# EAGLE design headphone (EAGLE 6.1)
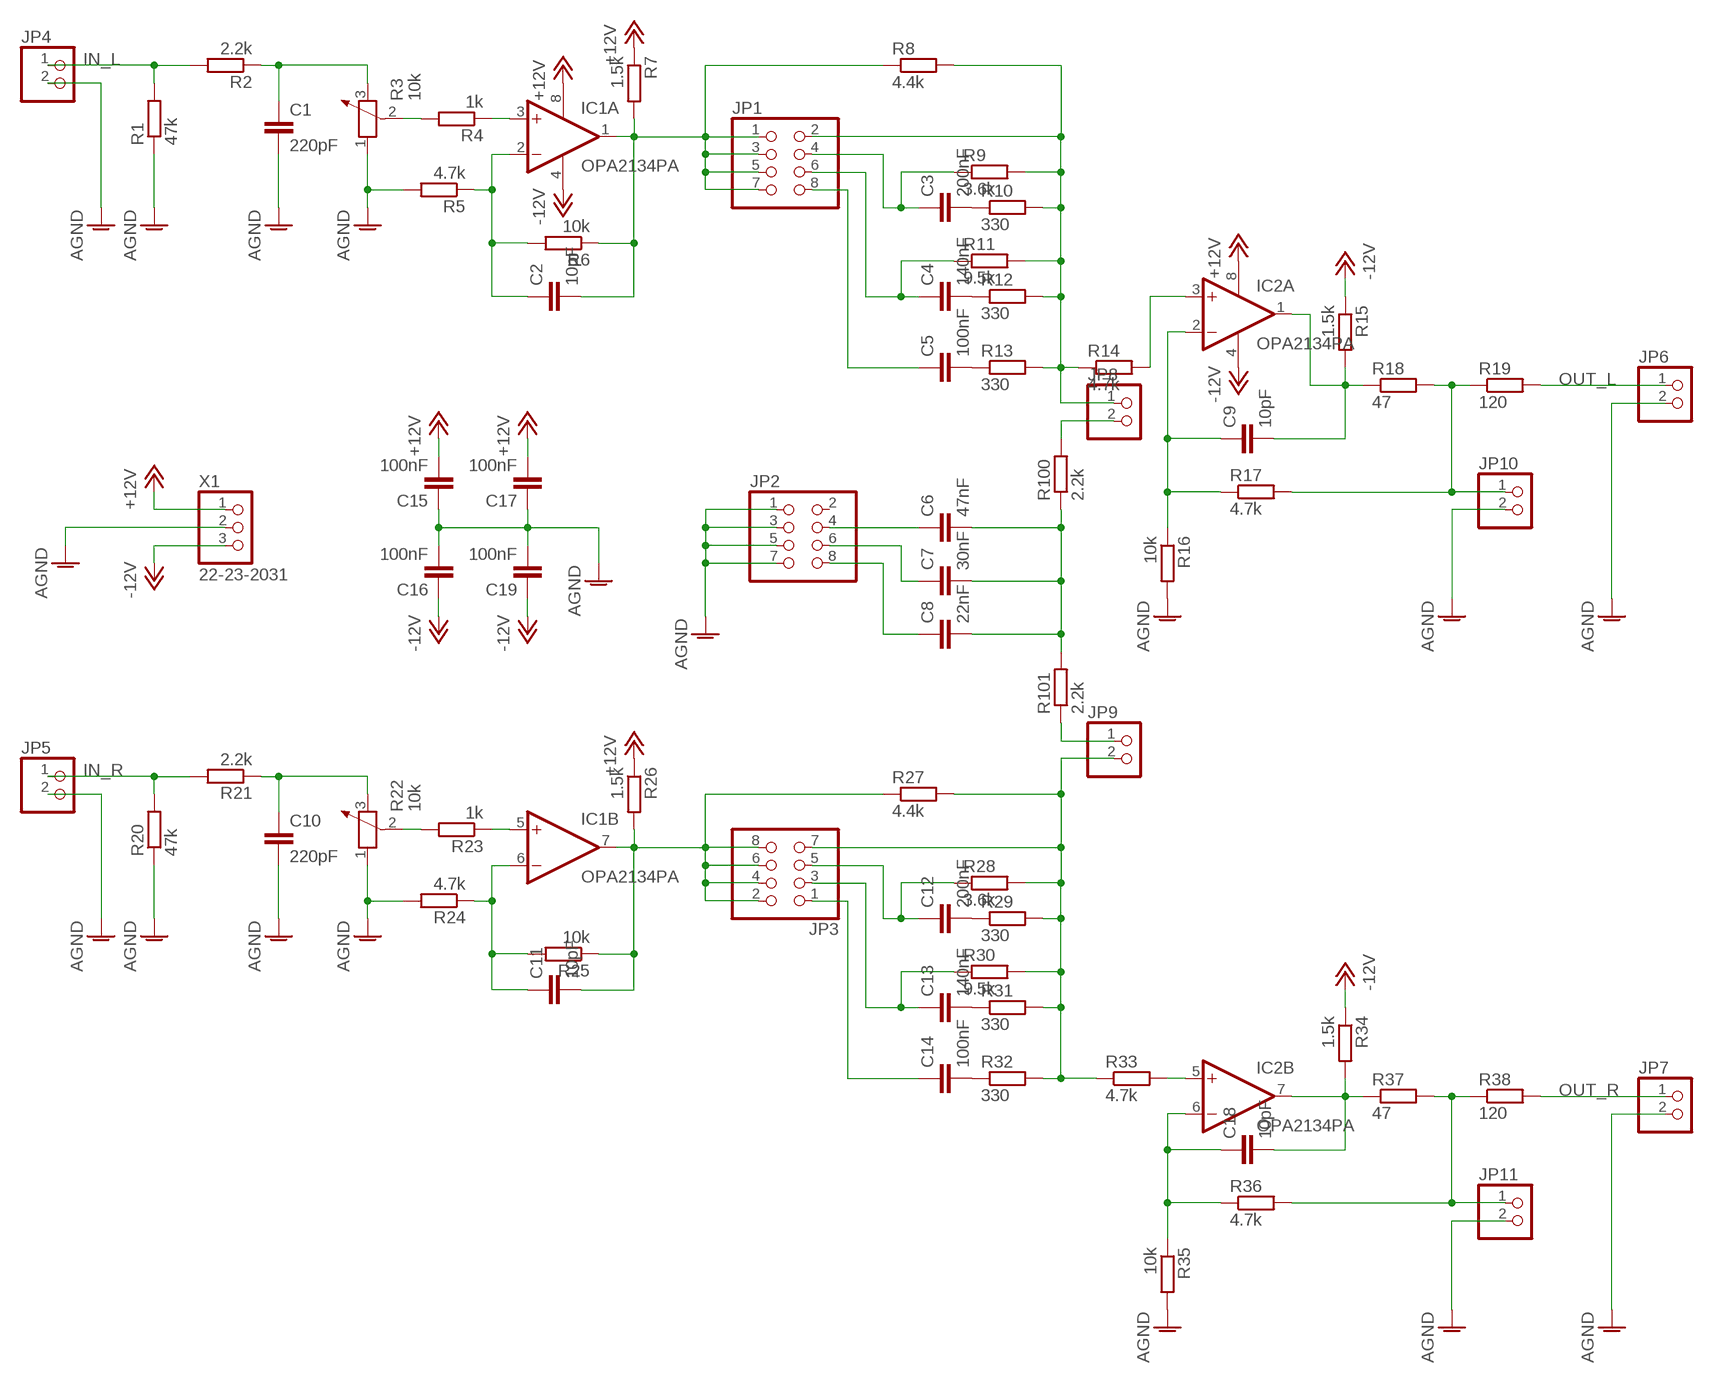
[diagram p0: schematic, sheet 1]

## Parts
C1  220pF  C-EU025-025X050  [C025-025X050]
C2  10pF  C-EU050-025X075  [C050-025X075]
C3  200nF  C-EU050-025X075  [C050-025X075]
C4  140nF  C-EU050-025X075  [C050-025X075]
C5  100nF  C-EU050-025X075  [C050-025X075]
C6  47nF  C-EU050-025X075  [C050-025X075]
C7  30nF  C-EU050-025X075  [C050-025X075]
C8  22nF  C-EU050-025X075  [C050-025X075]
C9  10pF  C-EU050-025X075  [C050-025X075]
C10  220pF  C-EU025-025X050  [C025-025X050]
C11  10pF  C-EU050-025X075  [C050-025X075]
C12  200nF  C-EU050-025X075  [C050-025X075]
C13  140nF  C-EU050-025X075  [C050-025X075]
C14  100nF  C-EU050-025X075  [C050-025X075]
C15  100nF  C-EU050-025X075  [C050-025X075]
C16  100nF  C-EU050-025X075  [C050-025X075]
C17  100nF  C-EU050-025X075  [C050-025X075]
C18  10pF  C-EU050-025X075  [C050-025X075]
C19  100nF  C-EU050-025X075  [C050-025X075]
IC1  OPA2134PA  [DIL08]
IC2  OPA2134PA  [DIL08]
JP1  PINHD-2X4  [2X04]
JP2  PINHD-2X4  [2X04]
JP3  PINHD-2X4  [2X04]
JP4  PINHD-1X2  [1X02]
JP5  PINHD-1X2  [1X02]
JP6  PINHD-1X2  [1X02]
JP7  PINHD-1X2  [1X02]
JP8  PINHD-1X2  [1X02]
JP9  PINHD-1X2  [1X02]
JP10  PINHD-1X2  [1X02]
JP11  PINHD-1X2  [1X02]
R1  47k  R-EU_0207/7  [0207/7]
R2  2.2k  R-EU_0207/7  [0207/7]
R3  10k  POTENTIOMETER_  [1X03]
R4  1k  R-EU_0207/7  [0207/7]
R5  4.7k  R-EU_0207/7  [0207/7]
R6  10k  R-EU_0207/7  [0207/7]
R7  1.5k  R-EU_0207/7  [0207/7]
R8  4.4k  R-EU_0207/7  [0207/7]
R9  3.6k  R-EU_0207/7  [0207/7]
R10  330  R-EU_0207/7  [0207/7]
R11  9.5k  R-EU_0207/7  [0207/7]
R12  330  R-EU_0207/7  [0207/7]
R13  330  R-EU_0207/7  [0207/7]
R14  4.7k  R-EU_0207/7  [0207/7]
R15  1.5k  R-EU_0207/7  [0207/7]
R16  10k  R-EU_0207/7  [0207/7]
R17  4.7k  R-EU_0207/7  [0207/7]
R18  47  R-EU_0207/7  [0207/7]
R19  120  R-EU_0207/7  [0207/7]
R20  47k  R-EU_0207/7  [0207/7]
R21  2.2k  R-EU_0207/7  [0207/7]
R22  10k  POTENTIOMETER_  [1X03]
R23  1k  R-EU_0207/7  [0207/7]
R24  4.7k  R-EU_0207/7  [0207/7]
R25  10k  R-EU_0207/7  [0207/7]
R26  1.5k  R-EU_0207/7  [0207/7]
R27  4.4k  R-EU_0207/7  [0207/7]
R28  3.6k  R-EU_0207/7  [0207/7]
R29  330  R-EU_0207/7  [0207/7]
R30  9.5k  R-EU_0207/7  [0207/7]
R31  330  R-EU_0207/7  [0207/7]
R32  330  R-EU_0207/7  [0207/7]
R33  4.7k  R-EU_0207/7  [0207/7]
R34  1.5k  R-EU_0207/7  [0207/7]
R35  10k  R-EU_0207/7  [0207/7]
R36  4.7k  R-EU_0207/7  [0207/7]
R37  47  R-EU_0207/7  [0207/7]
R38  120  R-EU_0207/7  [0207/7]
R100  2.2k  R-EU_0207/7  [0207/7]
R101  2.2k  R-EU_0207/7  [0207/7]
X1  22-23-2031  [22-23-2031]

## Nets
+12V: C15.2 C17.2 IC1.8(A:V+) IC2.8(A:V+) R7.1 R26.1 X1.1
-12V: C16.1 C19.1 IC1.4(A:V-) IC2.4(A:V-) R15.1 R34.1 X1.3
AGND: C1.2 C10.2 C15.1 C16.2 C17.1 C19.2 JP2.1 JP2.3 JP2.5 JP2.7 JP4.2 JP5.2 JP6.2 JP7.2 JP10.2 JP11.2 R1.1 R3.1 R5.2 R16.2 R20.1 R22.1 R24.2 R35.2 X1.2
IN_L: JP4.1 R1.2 R2.2
IN_R: JP5.1 R20.2 R21.2
N$1: JP9.1 R101.1
N$2: C1.1 R2.1 R3.3
N$3: R3.2 R4.2
N$4: JP1.2 JP8.1 R8.2 R9.2 R10.2 R11.2 R12.2 R13.2 R14.1
N$5: IC1.3(A:+IN) R4.1
N$6: C2.1 IC1.2(A:-IN) R5.1 R6.2
N$7: C2.2 IC1.1(A:OUT) JP1.1 JP1.3 JP1.5 JP1.7 R6.1 R7.2 R8.1
N$8: C3.2 R10.1
N$9: C3.1 JP1.4 R9.1
N$10: C5.2 R13.1
N$11: C4.2 R12.1
N$12: C4.1 JP1.6 R11.1
N$13: C5.1 JP1.8
N$14: C6.1 JP2.4
N$15: C7.1 JP2.6
N$16: C8.1 JP2.8
N$17: C6.2 C7.2 C8.2 R100.1 R101.2
N$18: IC2.3(A:+IN) R14.2
N$19: C9.1 IC2.2(A:-IN) R16.1 R17.1
N$20: C9.2 IC2.1(A:OUT) R15.2 R18.1
N$21: JP10.1 R17.2 R18.2 R19.1
N$22: JP8.2 R100.2
N$23: C10.1 R21.1 R22.3
N$24: R22.2 R23.2
N$25: IC1.5(B:+IN) R23.1
N$26: C11.1 IC1.6(B:-IN) R24.1 R25.2
N$27: C11.2 IC1.7(B:OUT) JP3.2 JP3.4 JP3.6 JP3.8 R25.1 R26.2 R27.1
N$28: C12.2 R29.1
N$29: C12.1 JP3.5 R28.1
N$30: C13.2 R31.1
N$31: C13.1 JP3.3 R30.1
N$32: JP3.7 JP9.2 R27.2 R28.2 R29.2 R30.2 R31.2 R32.2 R33.1
N$33: C14.2 R32.1
N$34: C14.1 JP3.1
N$39: IC2.5(B:+IN) R33.2
N$40: C18.1 IC2.6(B:-IN) R35.1 R36.1
N$41: C18.2 IC2.7(B:OUT) R34.2 R37.1
N$42: JP11.1 R36.2 R37.2 R38.1
OUT_L: JP6.1 R19.2
OUT_R: JP7.1 R38.2
Unconnected: JP2.2

## Library data of the parts
C1-C19 = amp:C-EU: CAPACITOR, European symbol
IC1 IC2 = amp:OPA2*: Dual Operational Amplifier Low Power, Single-Supply, Rail-To-Rail Operational Amplifier Source: http://focus.ti.com/lit/ds/symlink/opa2345.pdf http://focus.ti.com .. opa241.pdf http://focus.ti.com/lit/ds/symlink/opa2134.pdf
JP1-JP3 = amp:PINHD-2X4: PIN HEADER
JP4-JP11 = amp:PINHD-1X2: PIN HEADER
R1 R2 R4-R21 R23-R38 R100 R101 = amp:R-EU_: RESISTOR, European symbol
R3 R22 = amp:POTENTIOMETER_: Potentiometer
X1 = amp:22-23-2031: .100" (2.54mm) Center Header - 3 Pin

## Board
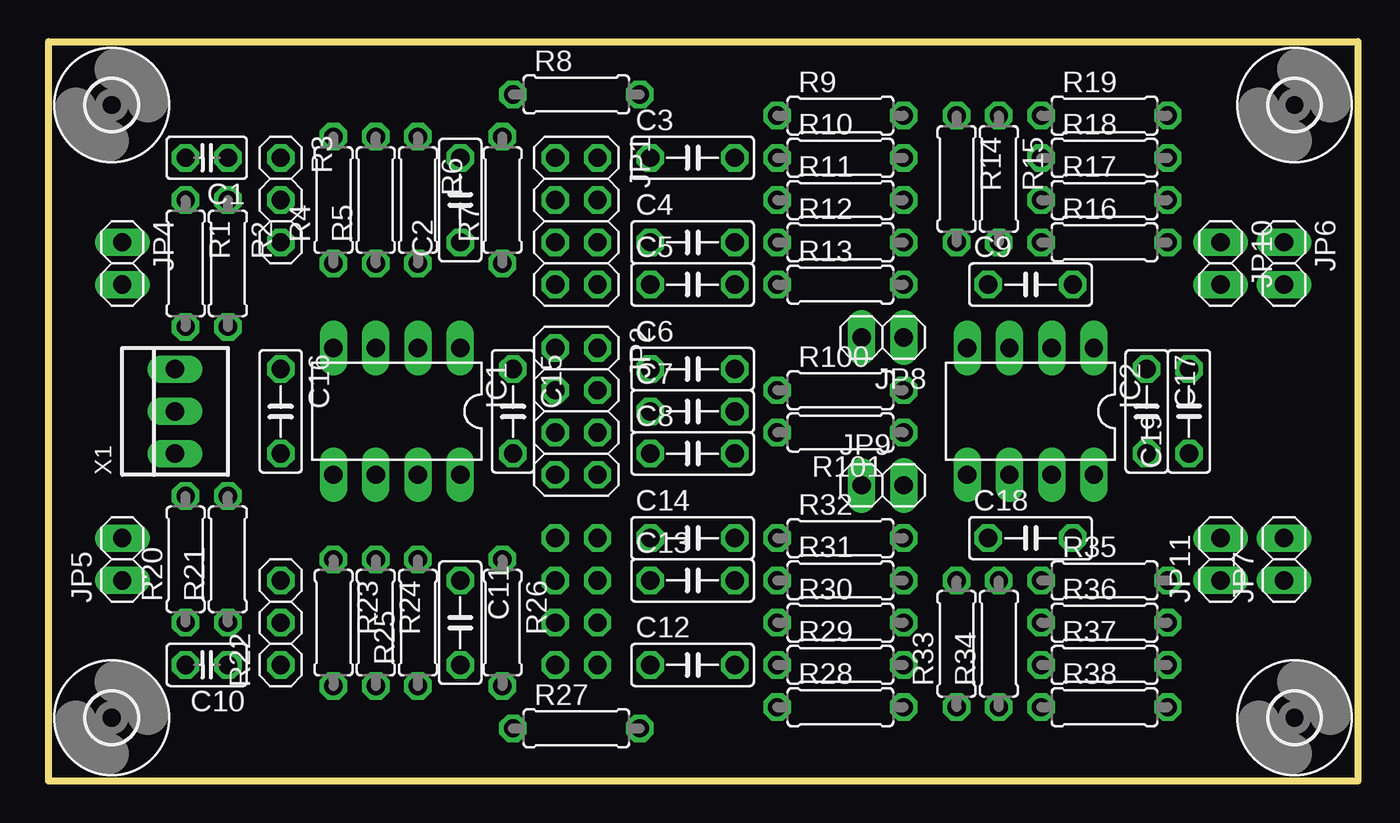
[diagram p1: board, top side]
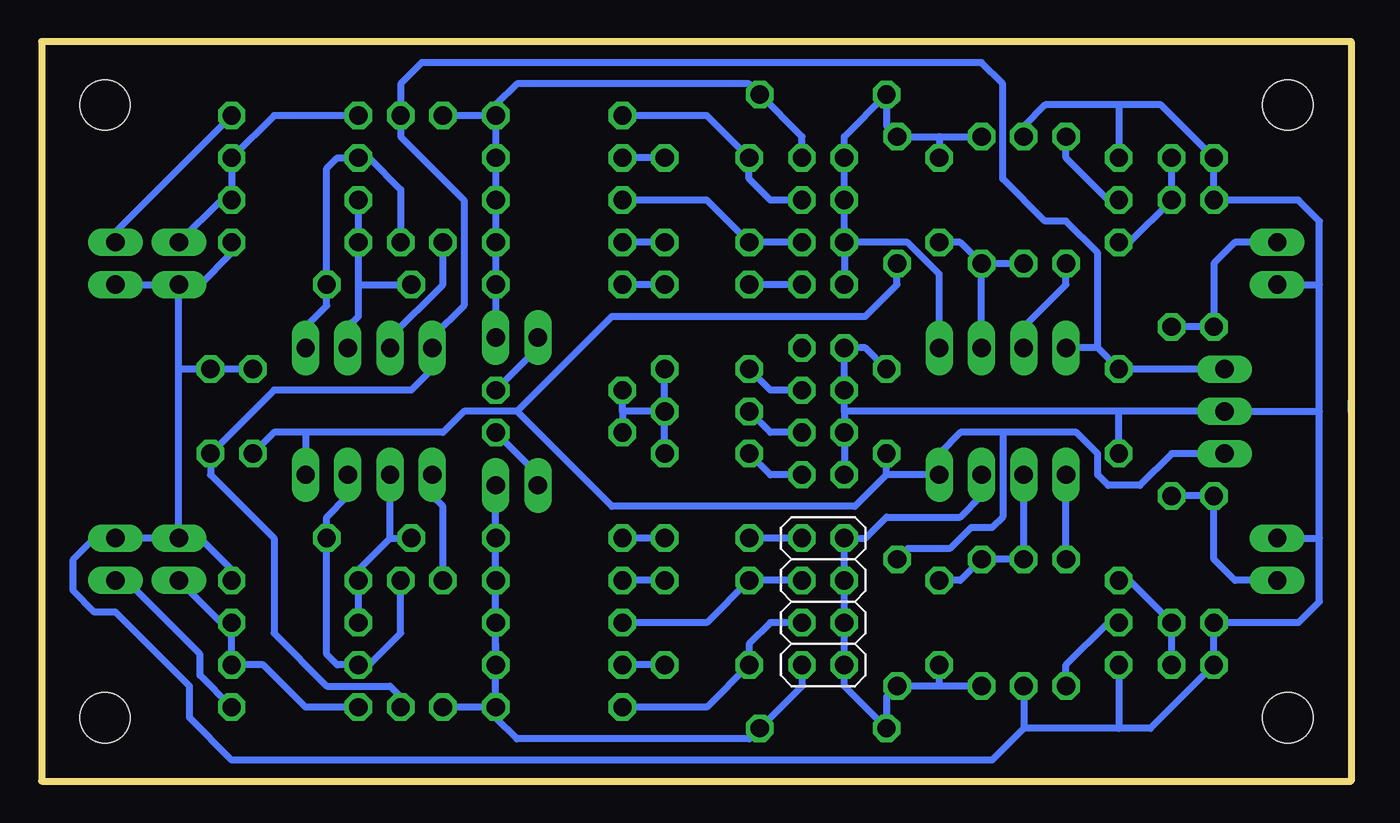
[diagram p2: board, bottom side, seen from below]

Size 78.74 x 44.45 mm. Coordinates in mm from the lower left corner, seen from the top.
Outline: 0.64,44.44 0,44.45
Outline: 0,44.45 0,0 78.74,0 78.74,44.45 0,44.45
Copper layers (1*16): Top 0.035mm / dielectric 1.5mm / Bottom 0.035mm
Design rules: minimum track width 10mil, minimum drill 24mil, track to track 8mil, track to pad 8mil, pad to pad 8mil, via to via 8mil, smd to smd 8mil, copper to edge 40mil, drill to drill 8mil, minimum pad ring 10mil, minimum via ring 8mil, stop-mask expansion 4mil, vias tented up to drill 0mil, thermal gap 10mil

### Footprints (pad centres in the part's own frame; a part is rotated, then mirrored left to right if it is on the bottom)
C025-025X050 = drill 1.1 octagon: 1 -1.27,0; 2 1.27,0
C050-025X075 = drill 1.1 octagon: 1 -2.54,0; 2 2.54,0
DIL08 = drill 1.1 long: 1 -3.81,-3.81; 2 -1.27,-3.81; 3 1.27,-3.81; 4 3.81,-3.81; 5 3.81,3.81; 6 1.27,3.81; 7 -1.27,3.81; 8 -3.81,3.81
2X04 = drill 1.1 octagon: 1 -3.81,-1.27; 2 -3.81,1.27; 3 -1.27,-1.27; 4 -1.27,1.27; 5 1.27,-1.27; 6 1.27,1.27; 7 3.81,-1.27; 8 3.81,1.27
1X02 = drill 1.1 long: 1 -1.27,0; 2 1.27,0
0207/7 = drill 1.1 octagon: 1 -3.81,0; 2 3.81,0
1X03 = drill 1.1 octagon: 1 -2.54,0; 2 0,0; 3 2.54,0
3,0 = hole 3: 0,0
22-23-2031 = drill 1.1 long: 1 -2.54,0; 2 0,0; 3 2.54,0

### Placement (x,y rotation side)
C1  9.53,37.47 180 top
C2  24.77,34.92 90 top
C3  38.73,37.47 0 top
C4  38.73,32.38 0 top
C5  38.73,29.84 0 top
C6  38.73,24.77 0 top
C7  38.73,22.23 0 top
C8  38.73,19.68 0 top
C9  59.05,29.84 0 top
C10  9.53,6.99 180 top
C11  24.77,9.53 270 top
C12  38.73,6.99 0 top
C13  38.73,12.06 0 top
C14  38.73,14.61 0 top
C15  27.94,22.23 270 top
C16  13.97,22.23 270 top
C17  66.04,22.23 270 top
C18  59.05,14.61 0 top
C19  68.58,22.23 90 top
IC1  20.95,22.23 180 top
IC2  59.05,22.23 180 top
JP1  31.75,33.66 270 top
JP2  31.75,22.23 270 top
JP3  31.75,10.79 270 bottom
JP4  4.45,31.11 270 top
JP5  4.45,13.34 90 top
JP6  74.3,31.11 270 top
JP7  74.3,13.34 90 top
JP8  50.16,26.67 180 top
JP9  50.16,17.78 0 top
JP10  70.48,31.11 270 top
JP11  70.48,13.34 90 top
R1  8.26,31.11 270 top
R2  10.79,31.11 270 top
R3  13.97,34.92 270 top
R4  17.14,34.92 90 top
R5  19.68,34.92 90 top
R6  22.23,34.92 270 top
R7  27.3,34.92 90 top
R8  31.75,41.27 0 top
R9  47.62,40.01 0 top
R10  47.62,37.47 0 top
R11  47.62,34.92 0 top
R12  47.62,32.38 0 top
R13  47.62,29.84 0 top
R14  54.61,36.2 270 top
R15  57.15,36.2 270 top
R16  63.5,32.38 0 top
R17  63.5,34.92 0 top
R18  63.5,37.47 0 top
R19  63.5,40.01 0 top
R20  8.26,13.34 90 top
R21  10.79,13.34 90 top
R22  13.97,9.53 90 top
R23  17.14,9.53 270 top
R24  19.68,9.53 270 top
R25  22.23,9.53 90 top
R26  27.3,9.53 270 top
R27  31.75,3.17 0 top
R28  47.62,4.45 0 top
R29  47.62,6.99 0 top
R30  47.62,9.53 0 top
R31  47.62,12.06 0 top
R32  47.62,14.61 0 top
R33  54.61,8.26 90 top
R34  57.15,8.26 90 top
R35  63.5,12.06 0 top
R36  63.5,9.53 0 top
R37  63.5,6.99 0 top
R38  63.5,4.45 0 top
R100  47.62,23.5 0 top
R101  47.62,20.95 180 top
U$1  [3,0]  3.81,3.81 0 top
U$2  [3,0]  3.81,40.64 0 top
U$3  [3,0]  74.93,40.64 0 top
U$4  [3,0]  74.93,3.81 0 top
X1  7.62,22.23 90 top

### Tracks (layer width: path | path; a pad name or v marks a point on that pad's centre or on a via)
+12V
  Bottom 0.406: 50.16,22.23 44.45,27.94 29.21,27.94 27.3,29.84 R7.1 | 50.16,22.23 44.45,16.51 29.84,16.51 27.94,18.41 | 50.16,22.23 53.34,22.23 54.61,20.95 62.87,20.95 | R26.1 26.67,13.97 24.13,13.97 22.86,15.24 21.59,15.24 20.95,15.88 20.95,20.95 | 20.95,20.95 16.51,20.95 15.24,19.68 15.24,18.41 14.61,17.78 12.7,17.78 10.79,19.68 X1.1 | 20.95,20.95 23.5,20.95 24.77,19.68 IC1.8 27.94,18.41 | 27.94,18.41 C15.2 | 62.87,20.95 64.77,20.95 C17.2 | 62.87,20.95 IC2.8
-12V
  Bottom 0.406: X1.3 C16.1 15.24,26.04 | R34.1 57.15,5.08 57.78,5.71 61.59,5.71 64.77,8.89 64.77,14.61 68.58,18.41 C19.1 64.77,23.5 56.52,23.5 55.24,24.77 IC2.4 55.24,26.67 53.34,28.57 53.34,34.92 57.15,38.73 R15.1 57.15,41.91 55.88,43.18 22.23,43.18 20.95,41.91 20.95,36.2 18.41,33.66 17.14,33.66 15.24,31.75 15.24,26.04 | 15.24,26.04 IC1.4
AGND
  Bottom 0.406: 13.97,40.64 11.43,40.64 C1.2 R1.1 3.17,34.92 1.91,33.66 1.91,29.84 | 13.97,40.64 18.41,40.64 19.68,39.37 R5.2 | 13.97,40.64 R3.1 | 1.91,14.61 1.91,10.79 3.17,9.53 R20.1 C10.2 12.06,3.17 13.97,3.17 | 1.91,14.61 1.91,22.23 | 1.91,22.23 1.91,29.84 | 13.97,22.23 X1.2 1.91,22.23 | 13.97,22.23 30.48,22.23 | JP2.7 JP2.5 30.48,22.23 | 30.48,22.23 JP2.3 JP2.1 29.21,26.04 C15.1 | C17.1 C19.2 70.48,24.77 | JP11.2 70.48,24.77 | 70.48,24.77 JP10.2 | JP11.2 69.22,14.61 67.31,12.7 R35.2 | 13.97,3.17 19.68,3.17 | 19.68,3.17 21.59,1.27 67.31,1.27 69.85,3.81 69.85,5.71 74.3,10.16 75.56,10.16 76.83,11.43 76.83,13.34 75.56,14.61 JP7.2 JP11.2 | JP10.2 69.22,29.84 67.31,31.75 R16.2 | JP4.2 1.91,29.84 | C16.2 13.97,22.23 | JP5.2 1.91,14.61 | R22.1 13.97,3.17 | R24.2 19.68,3.17 | JP6.2 JP10.2
IN_L
  Bottom 0.406: R2.2 R1.2 8.26,31.11 6.99,32.38 JP4.1
IN_R
  Bottom 0.406: R21.2 R20.2 8.26,13.34 6.99,12.06 JP5.1
N$1
  Bottom 0.406: JP9.1 48.9,18.41 R101.1
N$2
  Bottom 0.406: C1.1 R2.1 13.34,32.38 R3.3
N$3
  Bottom 0.406: R3.2 14.61,34.92 17.14,37.47 R4.2
N$4
  Bottom 0.406: R9.2 R10.2 R11.2 R12.2 R13.2 JP8.1 | R9.2 51.44,40.64 50.16,41.91 36.2,41.91 R8.2 33.02,38.73 JP1.2 | R9.2 R14.1
N$5
  Bottom 0.406: R4.1 17.14,29.84 19.68,27.3 IC1.3
N$6
  Bottom 0.406: R6.2 R5.1 R6.2 | IC1.2 R6.2 | R6.2 23.5,32.38 C2.1
N$7
  Bottom 0.406: JP1.5 JP1.7 | JP1.5 JP1.3 JP1.1 30.48,38.73 R8.1 27.94,39.37 R7.2 24.77,38.73 | IC1.1 24.77,30.48 26.67,32.38 JP1.5 | 24.77,38.73 R6.1 | 24.77,38.73 C2.2
N$8
  Bottom 0.406: C3.2 R10.1
N$9
  Bottom 0.406: R9.1 38.73,40.01 C3.1 36.2,36.2 34.92,34.92 JP1.4
N$10
  Bottom 0.406: C5.2 R13.1
N$11
  Bottom 0.406: C4.2 R12.1
N$12
  Bottom 0.406: R11.1 38.73,34.92 C4.1 JP1.6
N$13
  Bottom 0.406: JP1.8 C5.1
N$14
  Bottom 0.406: JP2.4 34.92,23.5 C6.1
N$15
  Bottom 0.406: JP2.6 34.92,20.95 C7.1
N$16
  Bottom 0.406: JP2.8 34.92,18.41 C8.1
N$17
  Bottom 0.406: 43.81,22.23 R101.2 | 43.81,22.23 R100.1 | C8.2 C7.2 | C7.2 C6.2 C7.2 | C7.2 43.81,22.23
N$18
  Bottom 0.406: IC2.3 57.78,26.67 54.61,29.84 R14.2
N$19
  Bottom 0.406: IC2.2 60.33,27.3 59.69,27.94 59.69,29.84 | R17.1 R16.1 59.69,29.84 | 59.69,29.84 C9.1
N$20
  Bottom 0.406: IC2.1 62.87,27.3 61.59,28.57 C9.2 61.59,36.83 60.96,37.47 R18.1 59.05,37.47 57.15,35.56 R15.2
N$21
  Bottom 0.406: R19.1 64.77,40.01 R18.2 R17.2 67.94,34.92 JP10.1
N$22
  Bottom 0.406: JP8.2 48.9,26.04 R100.2
N$23
  Bottom 0.406: C10.1 R21.1 13.34,12.06 R22.3
N$24
  Bottom 0.406: R23.2 17.14,6.99 14.61,9.53 R22.2
N$25
  Bottom 0.406: R23.1 IC1.5
N$26
  Bottom 0.406: IC1.6 R24.1 R25.2 23.5,12.06 C11.1
N$27
  Bottom 0.406: R25.1 24.77,5.71 | 24.77,5.71 R26.2 27.94,5.08 R27.1 30.48,5.71 JP3.8 JP3.6 JP3.4 JP3.2 29.21,14.61 27.94,15.88 23.5,15.88 22.23,17.14 IC1.7 | 24.77,5.71 C11.2
N$28
  Bottom 0.406: C12.2 R29.1
N$29
  Bottom 0.406: JP3.5 34.92,9.53 36.2,8.26 C12.1 38.73,4.45 R28.1
N$30
  Bottom 0.406: C13.2 R31.1
N$31
  Bottom 0.406: JP3.3 C13.1 38.73,9.53 R30.1
N$32
  Bottom 0.406: 51.44,8.26 R29.2 | R28.2 51.44,8.26 | 51.44,8.26 R30.2 R31.2 R32.2 JP9.2 | R28.2 51.44,3.81 50.16,2.54 36.2,2.54 R27.2 33.02,5.71 JP3.7 | R28.2 R33.1
N$33
  Bottom 0.406: C14.2 R32.1
N$34
  Bottom 0.406: JP3.1 C14.1
N$35
  Bottom 0.406: 0,22.23 0,22.86
N$39
  Bottom 0.406: IC2.5 55.24,17.14 54.61,16.51 R33.2
N$40
  Bottom 0.406: R36.1 R35.1 59.69,12.7 57.78,14.61 | 57.78,14.61 C18.1 | 57.78,14.61 IC2.6
N$41
  Bottom 0.406: IC2.7 60.33,17.14 61.59,15.88 C18.2 61.59,7.62 60.96,6.99 R37.1 59.05,6.99 57.15,8.89 R34.2
N$42
  Bottom 0.406: R38.1 62.87,4.45 65.41,6.99 R37.2 R36.2 67.94,9.53 JP11.1
OUT_L
  Bottom 0.406: R19.2 74.3,33.02 JP6.1
OUT_R
  Bottom 0.406: JP7.1 73.66,12.06 69.22,7.62 69.22,6.35 R38.2